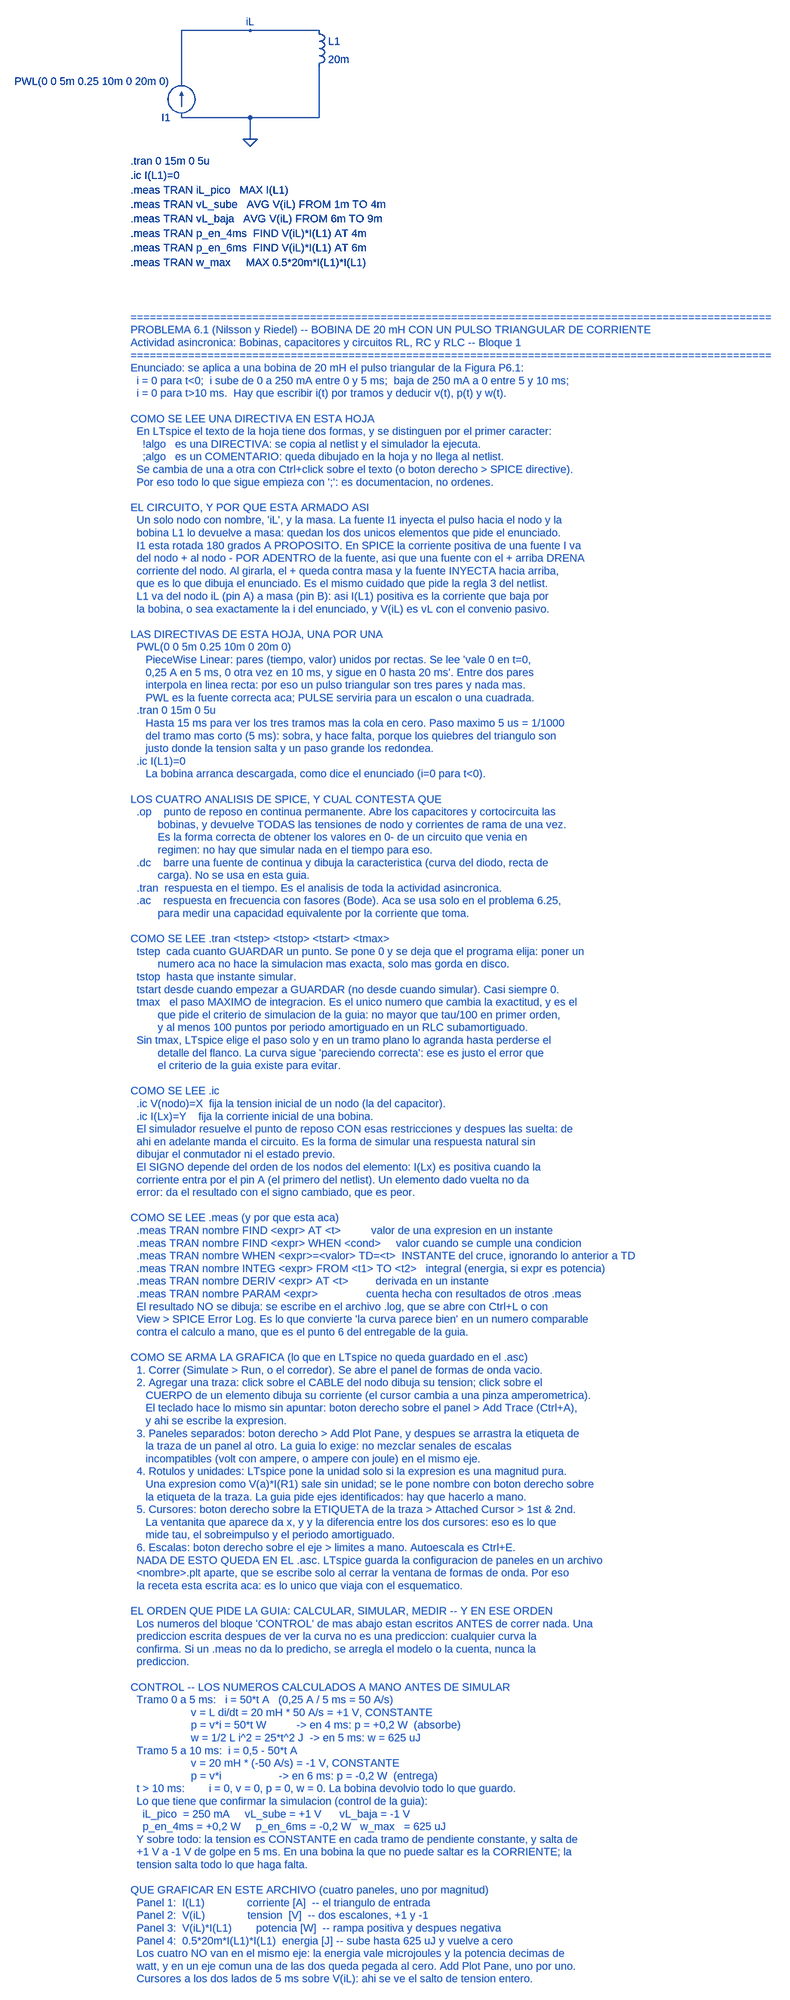
[diagram p0: schematic P6-01_bobina_pulso_triangular.asc]
P6-01_bobina_pulso_triangular.asc, the LTspice schematic file:
Version 4
SHEET 1 2000 2600
WIRE 176 224 176 112
WIRE 176 112 480 112
WIRE 480 192 480 304
WIRE 176 304 480 304
WIRE 328 304 328 352
FLAG 328 352 0
FLAG 328 112 iL
SYMBOL current 176 304 R180
WINDOW 123 0 0 Left 0
WINDOW 39 0 0 Left 0
SYMATTR InstName I1
SYMATTR Value PWL(0 0 5m 0.25 10m 0 20m 0)
SYMBOL ind 464 96 R0
SYMATTR InstName L1
SYMATTR Value 20m
SYMATTR Value2 Rser=1u
TEXT 64 400 Left 2 !.tran 0 15m 0 5u
TEXT 64 432 Left 2 !.ic I(L1)=0
TEXT 64 464 Left 2 !.meas TRAN iL_pico   MAX I(L1)
TEXT 64 496 Left 2 !.meas TRAN vL_sube   AVG V(iL) FROM 1m TO 4m
TEXT 64 528 Left 2 !.meas TRAN vL_baja   AVG V(iL) FROM 6m TO 9m
TEXT 64 560 Left 2 !.meas TRAN p_en_4ms  FIND V(iL)*I(L1) AT 4m
TEXT 64 592 Left 2 !.meas TRAN p_en_6ms  FIND V(iL)*I(L1) AT 6m
TEXT 64 624 Left 2 !.meas TRAN w_max     MAX 0.5*20m*I(L1)*I(L1)
TEXT 64 900 Left 2 ;====================================================================================================
TEXT 64 928 Left 2 ;PROBLEMA 6.1 (Nilsson y Riedel) -- BOBINA DE 20 mH CON UN PULSO TRIANGULAR DE CORRIENTE
TEXT 64 956 Left 2 ;Actividad asincronica: Bobinas, capacitores y circuitos RL, RC y RLC -- Bloque 1
TEXT 64 984 Left 2 ;====================================================================================================
TEXT 64 1012 Left 2 ;Enunciado: se aplica a una bobina de 20 mH el pulso triangular de la Figura P6.1:
TEXT 64 1040 Left 2 ;  i = 0 para t<0;  i sube de 0 a 250 mA entre 0 y 5 ms;  baja de 250 mA a 0 entre 5 y 10 ms;
TEXT 64 1068 Left 2 ;  i = 0 para t>10 ms.  Hay que escribir i(t) por tramos y deducir v(t), p(t) y w(t).
TEXT 64 1096 Left 2 ;
TEXT 64 1124 Left 2 ;COMO SE LEE UNA DIRECTIVA EN ESTA HOJA
TEXT 64 1152 Left 2 ;  En LTspice el texto de la hoja tiene dos formas, y se distinguen por el primer caracter:
TEXT 64 1180 Left 2 ;    !algo   es una DIRECTIVA: se copia al netlist y el simulador la ejecuta.
TEXT 64 1208 Left 2 ;    ;algo   es un COMENTARIO: queda dibujado en la hoja y no llega al netlist.
TEXT 64 1236 Left 2 ;  Se cambia de una a otra con Ctrl+click sobre el texto (o boton derecho > SPICE directive).
TEXT 64 1264 Left 2 ;  Por eso todo lo que sigue empieza con ';': es documentacion, no ordenes.
TEXT 64 1292 Left 2 ;
TEXT 64 1320 Left 2 ;EL CIRCUITO, Y POR QUE ESTA ARMADO ASI
TEXT 64 1348 Left 2 ;  Un solo nodo con nombre, 'iL', y la masa. La fuente I1 inyecta el pulso hacia el nodo y la
TEXT 64 1376 Left 2 ;  bobina L1 lo devuelve a masa: quedan los dos unicos elementos que pide el enunciado.
TEXT 64 1404 Left 2 ;  I1 esta rotada 180 grados A PROPOSITO. En SPICE la corriente positiva de una fuente I va
TEXT 64 1432 Left 2 ;  del nodo + al nodo - POR ADENTRO de la fuente, asi que una fuente con el + arriba DRENA
TEXT 64 1460 Left 2 ;  corriente del nodo. Al girarla, el + queda contra masa y la fuente INYECTA hacia arriba,
TEXT 64 1488 Left 2 ;  que es lo que dibuja el enunciado. Es el mismo cuidado que pide la regla 3 del netlist.
TEXT 64 1516 Left 2 ;  L1 va del nodo iL (pin A) a masa (pin B): asi I(L1) positiva es la corriente que baja por
TEXT 64 1544 Left 2 ;  la bobina, o sea exactamente la i del enunciado, y V(iL) es vL con el convenio pasivo.
TEXT 64 1572 Left 2 ;
TEXT 64 1600 Left 2 ;LAS DIRECTIVAS DE ESTA HOJA, UNA POR UNA
TEXT 64 1628 Left 2 ;  PWL(0 0 5m 0.25 10m 0 20m 0)
TEXT 64 1656 Left 2 ;     PieceWise Linear: pares (tiempo, valor) unidos por rectas. Se lee 'vale 0 en t=0,
TEXT 64 1684 Left 2 ;     0,25 A en 5 ms, 0 otra vez en 10 ms, y sigue en 0 hasta 20 ms'. Entre dos pares
TEXT 64 1712 Left 2 ;     interpola en linea recta: por eso un pulso triangular son tres pares y nada mas.
TEXT 64 1740 Left 2 ;     PWL es la fuente correcta aca; PULSE serviria para un escalon o una cuadrada.
TEXT 64 1768 Left 2 ;  .tran 0 15m 0 5u
TEXT 64 1796 Left 2 ;     Hasta 15 ms para ver los tres tramos mas la cola en cero. Paso maximo 5 us = 1/1000
TEXT 64 1824 Left 2 ;     del tramo mas corto (5 ms): sobra, y hace falta, porque los quiebres del triangulo son
TEXT 64 1852 Left 2 ;     justo donde la tension salta y un paso grande los redondea.
TEXT 64 1880 Left 2 ;  .ic I(L1)=0
TEXT 64 1908 Left 2 ;     La bobina arranca descargada, como dice el enunciado (i=0 para t<0).
TEXT 64 1936 Left 2 ;
TEXT 64 1964 Left 2 ;LOS CUATRO ANALISIS DE SPICE, Y CUAL CONTESTA QUE
TEXT 64 1992 Left 2 ;  .op    punto de reposo en continua permanente. Abre los capacitores y cortocircuita las
TEXT 64 2020 Left 2 ;         bobinas, y devuelve TODAS las tensiones de nodo y corrientes de rama de una vez.
TEXT 64 2048 Left 2 ;         Es la forma correcta de obtener los valores en 0- de un circuito que venia en
TEXT 64 2076 Left 2 ;         regimen: no hay que simular nada en el tiempo para eso.
TEXT 64 2104 Left 2 ;  .dc    barre una fuente de continua y dibuja la caracteristica (curva del diodo, recta de
TEXT 64 2132 Left 2 ;         carga). No se usa en esta guia.
TEXT 64 2160 Left 2 ;  .tran  respuesta en el tiempo. Es el analisis de toda la actividad asincronica.
TEXT 64 2188 Left 2 ;  .ac    respuesta en frecuencia con fasores (Bode). Aca se usa solo en el problema 6.25,
TEXT 64 2216 Left 2 ;         para medir una capacidad equivalente por la corriente que toma.
TEXT 64 2244 Left 2 ;
TEXT 64 2272 Left 2 ;COMO SE LEE .tran <tstep> <tstop> <tstart> <tmax>
TEXT 64 2300 Left 2 ;  tstep  cada cuanto GUARDAR un punto. Se pone 0 y se deja que el programa elija: poner un
TEXT 64 2328 Left 2 ;         numero aca no hace la simulacion mas exacta, solo mas gorda en disco.
TEXT 64 2356 Left 2 ;  tstop  hasta que instante simular.
TEXT 64 2384 Left 2 ;  tstart desde cuando empezar a GUARDAR (no desde cuando simular). Casi siempre 0.
TEXT 64 2412 Left 2 ;  tmax   el paso MAXIMO de integracion. Es el unico numero que cambia la exactitud, y es el
TEXT 64 2440 Left 2 ;         que pide el criterio de simulacion de la guia: no mayor que tau/100 en primer orden,
TEXT 64 2468 Left 2 ;         y al menos 100 puntos por periodo amortiguado en un RLC subamortiguado.
TEXT 64 2496 Left 2 ;  Sin tmax, LTspice elige el paso solo y en un tramo plano lo agranda hasta perderse el
TEXT 64 2524 Left 2 ;         detalle del flanco. La curva sigue 'pareciendo correcta': ese es justo el error que
TEXT 64 2552 Left 2 ;         el criterio de la guia existe para evitar.
TEXT 64 2580 Left 2 ;
TEXT 64 2608 Left 2 ;COMO SE LEE .ic
TEXT 64 2636 Left 2 ;  .ic V(nodo)=X  fija la tension inicial de un nodo (la del capacitor).
TEXT 64 2664 Left 2 ;  .ic I(Lx)=Y    fija la corriente inicial de una bobina.
TEXT 64 2692 Left 2 ;  El simulador resuelve el punto de reposo CON esas restricciones y despues las suelta: de
TEXT 64 2720 Left 2 ;  ahi en adelante manda el circuito. Es la forma de simular una respuesta natural sin
TEXT 64 2748 Left 2 ;  dibujar el conmutador ni el estado previo.
TEXT 64 2776 Left 2 ;  El SIGNO depende del orden de los nodos del elemento: I(Lx) es positiva cuando la
TEXT 64 2804 Left 2 ;  corriente entra por el pin A (el primero del netlist). Un elemento dado vuelta no da
TEXT 64 2832 Left 2 ;  error: da el resultado con el signo cambiado, que es peor.
TEXT 64 2860 Left 2 ;
TEXT 64 2888 Left 2 ;COMO SE LEE .meas (y por que esta aca)
TEXT 64 2916 Left 2 ;  .meas TRAN nombre FIND <expr> AT <t>          valor de una expresion en un instante
TEXT 64 2944 Left 2 ;  .meas TRAN nombre FIND <expr> WHEN <cond>     valor cuando se cumple una condicion
TEXT 64 2972 Left 2 ;  .meas TRAN nombre WHEN <expr>=<valor> TD=<t>  INSTANTE del cruce, ignorando lo anterior a TD
TEXT 64 3000 Left 2 ;  .meas TRAN nombre INTEG <expr> FROM <t1> TO <t2>   integral (energia, si expr es potencia)
TEXT 64 3028 Left 2 ;  .meas TRAN nombre DERIV <expr> AT <t>         derivada en un instante
TEXT 64 3056 Left 2 ;  .meas TRAN nombre PARAM <expr>                cuenta hecha con resultados de otros .meas
TEXT 64 3084 Left 2 ;  El resultado NO se dibuja: se escribe en el archivo .log, que se abre con Ctrl+L o con
TEXT 64 3112 Left 2 ;  View > SPICE Error Log. Es lo que convierte 'la curva parece bien' en un numero comparable
TEXT 64 3140 Left 2 ;  contra el calculo a mano, que es el punto 6 del entregable de la guia.
TEXT 64 3168 Left 2 ;
TEXT 64 3196 Left 2 ;COMO SE ARMA LA GRAFICA (lo que en LTspice no queda guardado en el .asc)
TEXT 64 3224 Left 2 ;  1. Correr (Simulate > Run, o el corredor). Se abre el panel de formas de onda vacio.
TEXT 64 3252 Left 2 ;  2. Agregar una traza: click sobre el CABLE del nodo dibuja su tension; click sobre el
TEXT 64 3280 Left 2 ;     CUERPO de un elemento dibuja su corriente (el cursor cambia a una pinza amperometrica).
TEXT 64 3308 Left 2 ;     El teclado hace lo mismo sin apuntar: boton derecho sobre el panel > Add Trace (Ctrl+A),
TEXT 64 3336 Left 2 ;     y ahi se escribe la expresion.
TEXT 64 3364 Left 2 ;  3. Paneles separados: boton derecho > Add Plot Pane, y despues se arrastra la etiqueta de
TEXT 64 3392 Left 2 ;     la traza de un panel al otro. La guia lo exige: no mezclar senales de escalas
TEXT 64 3420 Left 2 ;     incompatibles (volt con ampere, o ampere con joule) en el mismo eje.
TEXT 64 3448 Left 2 ;  4. Rotulos y unidades: LTspice pone la unidad solo si la expresion es una magnitud pura.
TEXT 64 3476 Left 2 ;     Una expresion como V(a)*I(R1) sale sin unidad; se le pone nombre con boton derecho sobre
TEXT 64 3504 Left 2 ;     la etiqueta de la traza. La guia pide ejes identificados: hay que hacerlo a mano.
TEXT 64 3532 Left 2 ;  5. Cursores: boton derecho sobre la ETIQUETA de la traza > Attached Cursor > 1st & 2nd.
TEXT 64 3560 Left 2 ;     La ventanita que aparece da x, y y la diferencia entre los dos cursores: eso es lo que
TEXT 64 3588 Left 2 ;     mide tau, el sobreimpulso y el periodo amortiguado.
TEXT 64 3616 Left 2 ;  6. Escalas: boton derecho sobre el eje > limites a mano. Autoescala es Ctrl+E.
TEXT 64 3644 Left 2 ;  NADA DE ESTO QUEDA EN EL .asc. LTspice guarda la configuracion de paneles en un archivo
TEXT 64 3672 Left 2 ;  <nombre>.plt aparte, que se escribe solo al cerrar la ventana de formas de onda. Por eso
TEXT 64 3700 Left 2 ;  la receta esta escrita aca: es lo unico que viaja con el esquematico.
TEXT 64 3728 Left 2 ;
TEXT 64 3756 Left 2 ;EL ORDEN QUE PIDE LA GUIA: CALCULAR, SIMULAR, MEDIR -- Y EN ESE ORDEN
TEXT 64 3784 Left 2 ;  Los numeros del bloque 'CONTROL' de mas abajo estan escritos ANTES de correr nada. Una
TEXT 64 3812 Left 2 ;  prediccion escrita despues de ver la curva no es una prediccion: cualquier curva la
TEXT 64 3840 Left 2 ;  confirma. Si un .meas no da lo predicho, se arregla el modelo o la cuenta, nunca la
TEXT 64 3868 Left 2 ;  prediccion.
TEXT 64 3896 Left 2 ;
TEXT 64 3924 Left 2 ;CONTROL -- LOS NUMEROS CALCULADOS A MANO ANTES DE SIMULAR
TEXT 64 3952 Left 2 ;  Tramo 0 a 5 ms:   i = 50*t A   (0,25 A / 5 ms = 50 A/s)
TEXT 64 3980 Left 2 ;                    v = L di/dt = 20 mH * 50 A/s = +1 V, CONSTANTE
TEXT 64 4008 Left 2 ;                    p = v*i = 50*t W          -> en 4 ms: p = +0,2 W  (absorbe)
TEXT 64 4036 Left 2 ;                    w = 1/2 L i^2 = 25*t^2 J  -> en 5 ms: w = 625 uJ
TEXT 64 4064 Left 2 ;  Tramo 5 a 10 ms:  i = 0,5 - 50*t A
TEXT 64 4092 Left 2 ;                    v = 20 mH * (-50 A/s) = -1 V, CONSTANTE
TEXT 64 4120 Left 2 ;                    p = v*i                   -> en 6 ms: p = -0,2 W  (entrega)
TEXT 64 4148 Left 2 ;  t > 10 ms:        i = 0, v = 0, p = 0, w = 0. La bobina devolvio todo lo que guardo.
TEXT 64 4176 Left 2 ;  Lo que tiene que confirmar la simulacion (control de la guia):
TEXT 64 4204 Left 2 ;    iL_pico  = 250 mA     vL_sube = +1 V      vL_baja = -1 V
TEXT 64 4232 Left 2 ;    p_en_4ms = +0,2 W     p_en_6ms = -0,2 W   w_max   = 625 uJ
TEXT 64 4260 Left 2 ;  Y sobre todo: la tension es CONSTANTE en cada tramo de pendiente constante, y salta de
TEXT 64 4288 Left 2 ;  +1 V a -1 V de golpe en 5 ms. En una bobina la que no puede saltar es la CORRIENTE; la
TEXT 64 4316 Left 2 ;  tension salta todo lo que haga falta.
TEXT 64 4344 Left 2 ;
TEXT 64 4372 Left 2 ;QUE GRAFICAR EN ESTE ARCHIVO (cuatro paneles, uno por magnitud)
TEXT 64 4400 Left 2 ;  Panel 1:  I(L1)              corriente [A]  -- el triangulo de entrada
TEXT 64 4428 Left 2 ;  Panel 2:  V(iL)              tension  [V]  -- dos escalones, +1 y -1
TEXT 64 4456 Left 2 ;  Panel 3:  V(iL)*I(L1)        potencia [W]  -- rampa positiva y despues negativa
TEXT 64 4484 Left 2 ;  Panel 4:  0.5*20m*I(L1)*I(L1)  energia [J] -- sube hasta 625 uJ y vuelve a cero
TEXT 64 4512 Left 2 ;  Los cuatro NO van en el mismo eje: la energia vale microjoules y la potencia decimas de
TEXT 64 4540 Left 2 ;  watt, y en un eje comun una de las dos queda pegada al cero. Add Plot Pane, uno por uno.
TEXT 64 4568 Left 2 ;  Cursores a los dos lados de 5 ms sobre V(iL): ahi se ve el salto de tension entero.

The netlist it stands for:
* P6-01_bobina_pulso_triangular.asc
I1 0 iL PWL(0 0 5m 0.25 10m 0 20m 0)
L1 iL 0 20m Rser=1u
.tran 0 15m 0 5u
.ic I(L1)=0
.meas TRAN iL_pico   MAX I(L1)
.meas TRAN vL_sube   AVG V(iL) FROM 1m TO 4m
.meas TRAN vL_baja   AVG V(iL) FROM 6m TO 9m
.meas TRAN p_en_4ms  FIND V(iL)*I(L1) AT 4m
.meas TRAN p_en_6ms  FIND V(iL)*I(L1) AT 6m
.meas TRAN w_max     MAX 0.5*20m*I(L1)*I(L1)
* ====================================================================================================
* PROBLEMA 6.1 (Nilsson y Riedel) -- BOBINA DE 20 mH CON UN PULSO TRIANGULAR DE CORRIENTE
* Actividad asincronica: Bobinas, capacitores y circuitos RL, RC y RLC -- Bloque 1
* ====================================================================================================
* Enunciado: se aplica a una bobina de 20 mH el pulso triangular de la Figura P6.1:
*   i = 0 para t<0;  i sube de 0 a 250 mA entre 0 y 5 ms;  baja de 250 mA a 0 entre 5 y 10 ms;
*   i = 0 para t>10 ms.  Hay que escribir i(t) por tramos y deducir v(t), p(t) y w(t).
* COMO SE LEE UNA DIRECTIVA EN ESTA HOJA
*   En LTspice el texto de la hoja tiene dos formas, y se distinguen por el primer caracter:
*     !algo   es una DIRECTIVA: se copia al netlist y el simulador la ejecuta.
*     ;algo   es un COMENTARIO: queda dibujado en la hoja y no llega al netlist.
*   Se cambia de una a otra con Ctrl+click sobre el texto (o boton derecho > SPICE directive).
*   Por eso todo lo que sigue empieza con ';': es documentacion, no ordenes.
* EL CIRCUITO, Y POR QUE ESTA ARMADO ASI
*   Un solo nodo con nombre, 'iL', y la masa. La fuente I1 inyecta el pulso hacia el nodo y la
*   bobina L1 lo devuelve a masa: quedan los dos unicos elementos que pide el enunciado.
*   I1 esta rotada 180 grados A PROPOSITO. En SPICE la corriente positiva de una fuente I va
*   del nodo + al nodo - POR ADENTRO de la fuente, asi que una fuente con el + arriba DRENA
*   corriente del nodo. Al girarla, el + queda contra masa y la fuente INYECTA hacia arriba,
*   que es lo que dibuja el enunciado. Es el mismo cuidado que pide la regla 3 del netlist.
*   L1 va del nodo iL (pin A) a masa (pin B): asi I(L1) positiva es la corriente que baja por
*   la bobina, o sea exactamente la i del enunciado, y V(iL) es vL con el convenio pasivo.
* LAS DIRECTIVAS DE ESTA HOJA, UNA POR UNA
*   PWL(0 0 5m 0.25 10m 0 20m 0)
*      PieceWise Linear: pares (tiempo, valor) unidos por rectas. Se lee 'vale 0 en t=0,
*      0,25 A en 5 ms, 0 otra vez en 10 ms, y sigue en 0 hasta 20 ms'. Entre dos pares
*      interpola en linea recta: por eso un pulso triangular son tres pares y nada mas.
*      PWL es la fuente correcta aca; PULSE serviria para un escalon o una cuadrada.
*   .tran 0 15m 0 5u
*      Hasta 15 ms para ver los tres tramos mas la cola en cero. Paso maximo 5 us = 1/1000
*      del tramo mas corto (5 ms): sobra, y hace falta, porque los quiebres del triangulo son
*      justo donde la tension salta y un paso grande los redondea.
*   .ic I(L1)=0
*      La bobina arranca descargada, como dice el enunciado (i=0 para t<0).
* LOS CUATRO ANALISIS DE SPICE, Y CUAL CONTESTA QUE
*   .op    punto de reposo en continua permanente. Abre los capacitores y cortocircuita las
*          bobinas, y devuelve TODAS las tensiones de nodo y corrientes de rama de una vez.
*          Es la forma correcta de obtener los valores en 0- de un circuito que venia en
*          regimen: no hay que simular nada en el tiempo para eso.
*   .dc    barre una fuente de continua y dibuja la caracteristica (curva del diodo, recta de
*          carga). No se usa en esta guia.
*   .tran  respuesta en el tiempo. Es el analisis de toda la actividad asincronica.
*   .ac    respuesta en frecuencia con fasores (Bode). Aca se usa solo en el problema 6.25,
*          para medir una capacidad equivalente por la corriente que toma.
* COMO SE LEE .tran <tstep> <tstop> <tstart> <tmax>
*   tstep  cada cuanto GUARDAR un punto. Se pone 0 y se deja que el programa elija: poner un
*          numero aca no hace la simulacion mas exacta, solo mas gorda en disco.
*   tstop  hasta que instante simular.
*   tstart desde cuando empezar a GUARDAR (no desde cuando simular). Casi siempre 0.
*   tmax   el paso MAXIMO de integracion. Es el unico numero que cambia la exactitud, y es el
*          que pide el criterio de simulacion de la guia: no mayor que tau/100 en primer orden,
*          y al menos 100 puntos por periodo amortiguado en un RLC subamortiguado.
*   Sin tmax, LTspice elige el paso solo y en un tramo plano lo agranda hasta perderse el
*          detalle del flanco. La curva sigue 'pareciendo correcta': ese es justo el error que
*          el criterio de la guia existe para evitar.
* COMO SE LEE .ic
*   .ic V(nodo)=X  fija la tension inicial de un nodo (la del capacitor).
*   .ic I(Lx)=Y    fija la corriente inicial de una bobina.
*   El simulador resuelve el punto de reposo CON esas restricciones y despues las suelta: de
*   ahi en adelante manda el circuito. Es la forma de simular una respuesta natural sin
*   dibujar el conmutador ni el estado previo.
*   El SIGNO depende del orden de los nodos del elemento: I(Lx) es positiva cuando la
*   corriente entra por el pin A (el primero del netlist). Un elemento dado vuelta no da
*   error: da el resultado con el signo cambiado, que es peor.
* COMO SE LEE .meas (y por que esta aca)
*   .meas TRAN nombre FIND <expr> AT <t>          valor de una expresion en un instante
*   .meas TRAN nombre FIND <expr> WHEN <cond>     valor cuando se cumple una condicion
*   .meas TRAN nombre WHEN <expr>=<valor> TD=<t>  INSTANTE del cruce, ignorando lo anterior a TD
*   .meas TRAN nombre INTEG <expr> FROM <t1> TO <t2>   integral (energia, si expr es potencia)
*   .meas TRAN nombre DERIV <expr> AT <t>         derivada en un instante
*   .meas TRAN nombre PARAM <expr>                cuenta hecha con resultados de otros .meas
*   El resultado NO se dibuja: se escribe en el archivo .log, que se abre con Ctrl+L o con
*   View > SPICE Error Log. Es lo que convierte 'la curva parece bien' en un numero comparable
*   contra el calculo a mano, que es el punto 6 del entregable de la guia.
* COMO SE ARMA LA GRAFICA (lo que en LTspice no queda guardado en el .asc)
*   1. Correr (Simulate > Run, o el corredor). Se abre el panel de formas de onda vacio.
*   2. Agregar una traza: click sobre el CABLE del nodo dibuja su tension; click sobre el
*      CUERPO de un elemento dibuja su corriente (el cursor cambia a una pinza amperometrica).
*      El teclado hace lo mismo sin apuntar: boton derecho sobre el panel > Add Trace (Ctrl+A),
*      y ahi se escribe la expresion.
*   3. Paneles separados: boton derecho > Add Plot Pane, y despues se arrastra la etiqueta de
*      la traza de un panel al otro. La guia lo exige: no mezclar senales de escalas
*      incompatibles (volt con ampere, o ampere con joule) en el mismo eje.
*   4. Rotulos y unidades: LTspice pone la unidad solo si la expresion es una magnitud pura.
*      Una expresion como V(a)*I(R1) sale sin unidad; se le pone nombre con boton derecho sobre
*      la etiqueta de la traza. La guia pide ejes identificados: hay que hacerlo a mano.
*   5. Cursores: boton derecho sobre la ETIQUETA de la traza > Attached Cursor > 1st & 2nd.
*      La ventanita que aparece da x, y y la diferencia entre los dos cursores: eso es lo que
*      mide tau, el sobreimpulso y el periodo amortiguado.
*   6. Escalas: boton derecho sobre el eje > limites a mano. Autoescala es Ctrl+E.
*   NADA DE ESTO QUEDA EN EL .asc. LTspice guarda la configuracion de paneles en un archivo
*   <nombre>.plt aparte, que se escribe solo al cerrar la ventana de formas de onda. Por eso
*   la receta esta escrita aca: es lo unico que viaja con el esquematico.
* EL ORDEN QUE PIDE LA GUIA: CALCULAR, SIMULAR, MEDIR -- Y EN ESE ORDEN
*   Los numeros del bloque 'CONTROL' de mas abajo estan escritos ANTES de correr nada. Una
*   prediccion escrita despues de ver la curva no es una prediccion: cualquier curva la
*   confirma. Si un .meas no da lo predicho, se arregla el modelo o la cuenta, nunca la
*   prediccion.
* CONTROL -- LOS NUMEROS CALCULADOS A MANO ANTES DE SIMULAR
*   Tramo 0 a 5 ms:   i = 50*t A   (0,25 A / 5 ms = 50 A/s)
*                     v = L di/dt = 20 mH * 50 A/s = +1 V, CONSTANTE
*                     p = v*i = 50*t W          -> en 4 ms: p = +0,2 W  (absorbe)
*                     w = 1/2 L i^2 = 25*t^2 J  -> en 5 ms: w = 625 uJ
*   Tramo 5 a 10 ms:  i = 0,5 - 50*t A
*                     v = 20 mH * (-50 A/s) = -1 V, CONSTANTE
*                     p = v*i                   -> en 6 ms: p = -0,2 W  (entrega)
*   t > 10 ms:        i = 0, v = 0, p = 0, w = 0. La bobina devolvio todo lo que guardo.
*   Lo que tiene que confirmar la simulacion (control de la guia):
*     iL_pico  = 250 mA     vL_sube = +1 V      vL_baja = -1 V
*     p_en_4ms = +0,2 W     p_en_6ms = -0,2 W   w_max   = 625 uJ
*   Y sobre todo: la tension es CONSTANTE en cada tramo de pendiente constante, y salta de
*   +1 V a -1 V de golpe en 5 ms. En una bobina la que no puede saltar es la CORRIENTE; la
*   tension salta todo lo que haga falta.
* QUE GRAFICAR EN ESTE ARCHIVO (cuatro paneles, uno por magnitud)
*   Panel 1:  I(L1)              corriente [A]  -- el triangulo de entrada
*   Panel 2:  V(iL)              tension  [V]  -- dos escalones, +1 y -1
*   Panel 3:  V(iL)*I(L1)        potencia [W]  -- rampa positiva y despues negativa
*   Panel 4:  0.5*20m*I(L1)*I(L1)  energia [J] -- sube hasta 625 uJ y vuelve a cero
*   Los cuatro NO van en el mismo eje: la energia vale microjoules y la potencia decimas de
*   watt, y en un eje comun una de las dos queda pegada al cero. Add Plot Pane, uno por uno.
*   Cursores a los dos lados de 5 ms sobre V(iL): ahi se ve el salto de tension entero.
.backanno
.end